# Altium project LEDS.PrjPcb
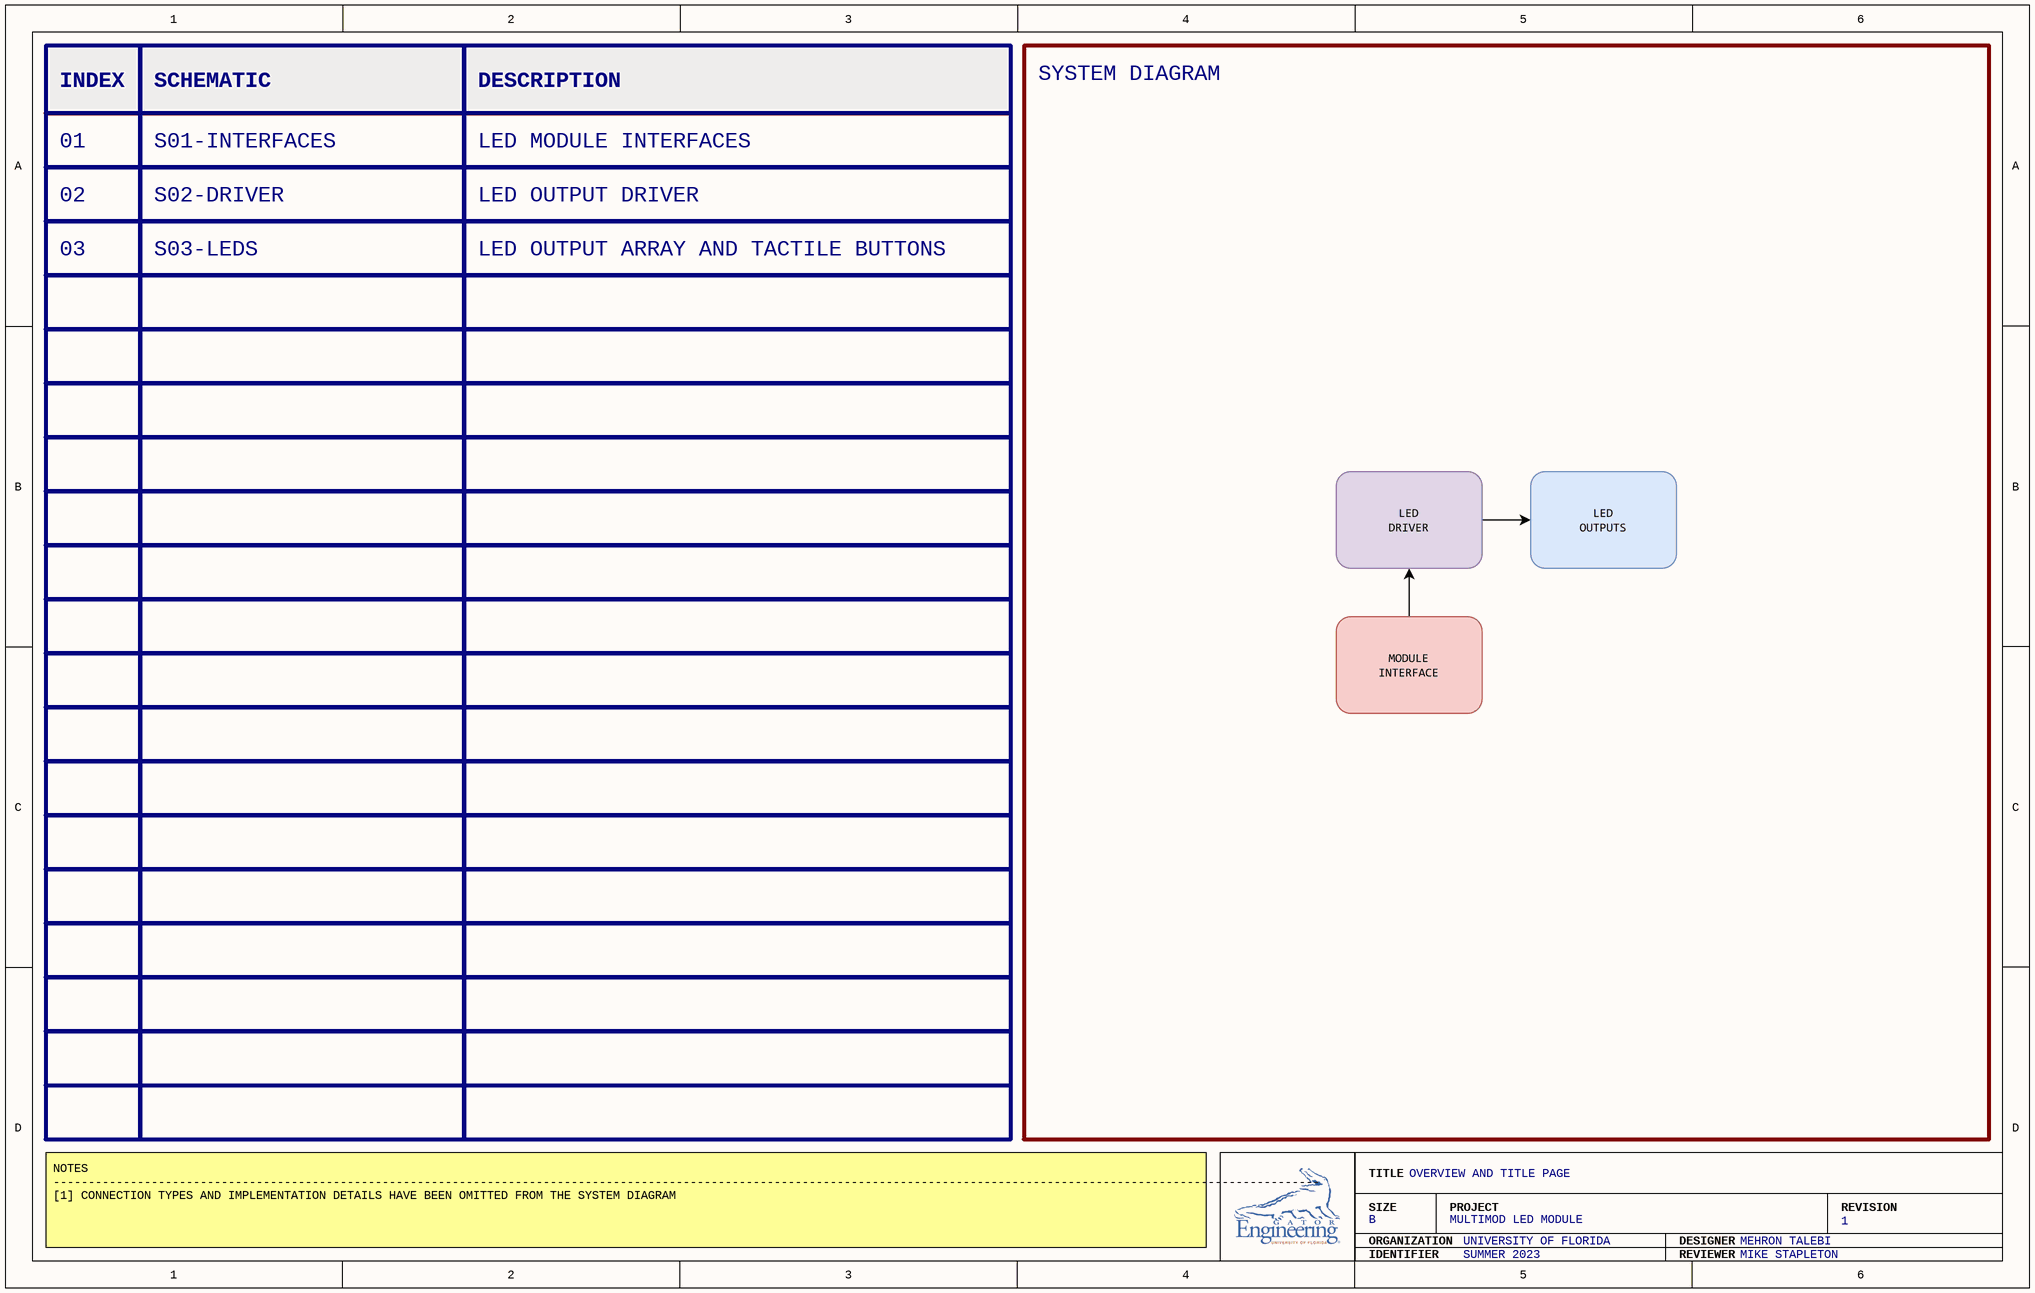
[diagram p0: S00-OVERVIEW.SchDoc]
4 sheets, 35 parts. Net scope: flat (ports and power ports of the same name join across sheets).
Board file: P01-LEDS.PcbDoc
Sheets:
  S00-OVERVIEW.SchDoc
  S01-INTERFACES.SchDoc
  S02-DRIVER.SchDoc
  S03-LEDS.SchDoc

## Sheet S00-OVERVIEW.SchDoc
size B; SheetNumber: 1; SheetTotal: 4; BLOCK-TITLE: OVERVIEW AND TITLE PAGE; BLOCK-SIZE: B; BLOCK-PROJECT: MULTIMOD LED MODULE; BLOCK-REVISION: 1; BLOCK-ORGANIZATION: UNIVERSITY OF FLORIDA; BLOCK-DESIGNER: MEHRON TALEBI; BLOCK-IDENTIFIER: SUMMER 2023; BLOCK-REVIEWER: MIKE STAPLETON

### Notes on the sheet
- INDEX
- SCHEMATIC
- DESCRIPTION
- SYSTEM DIAGRAM
- 01
- S01-INTERFACES
- LED MODULE INTERFACES
- 02
- 03
- S02-DRIVER
- S03-LEDS
- LED OUTPUT DRIVER
- LED OUTPUT ARRAY AND TACTILE BUTTONS
- NOTES
  -------------------------------------------------------------------------------------------------------------------------------------------------------------------------------------
  [1] CONNECTION TYPES AND IMPLEMENTATION DETAILS HAVE BEEN OMITTED FROM THE SYSTEM DIAGRAM
- TITLE
- SIZE
- ORGANIZATION
- PROJECT
- DESIGNER
- REVISION
- IDENTIFIER
- REVIEWER

## Sheet S01-INTERFACES.SchDoc
size B; SheetNumber: 2; SheetTotal: 4; BLOCK-TITLE: LED MODULE INTERFACES AND TACTILE BUTTONS; BLOCK-SIZE: B; BLOCK-PROJECT: MULTIMOD LED MODULE; BLOCK-REVISION: 1; BLOCK-ORGANIZATION: UNIVERSITY OF FLORIDA; BLOCK-DESIGNER: MEHRON TALEBI; BLOCK-IDENTIFIER: SUMMER 2023; BLOCK-REVIEWER: MIKE STAPLETON
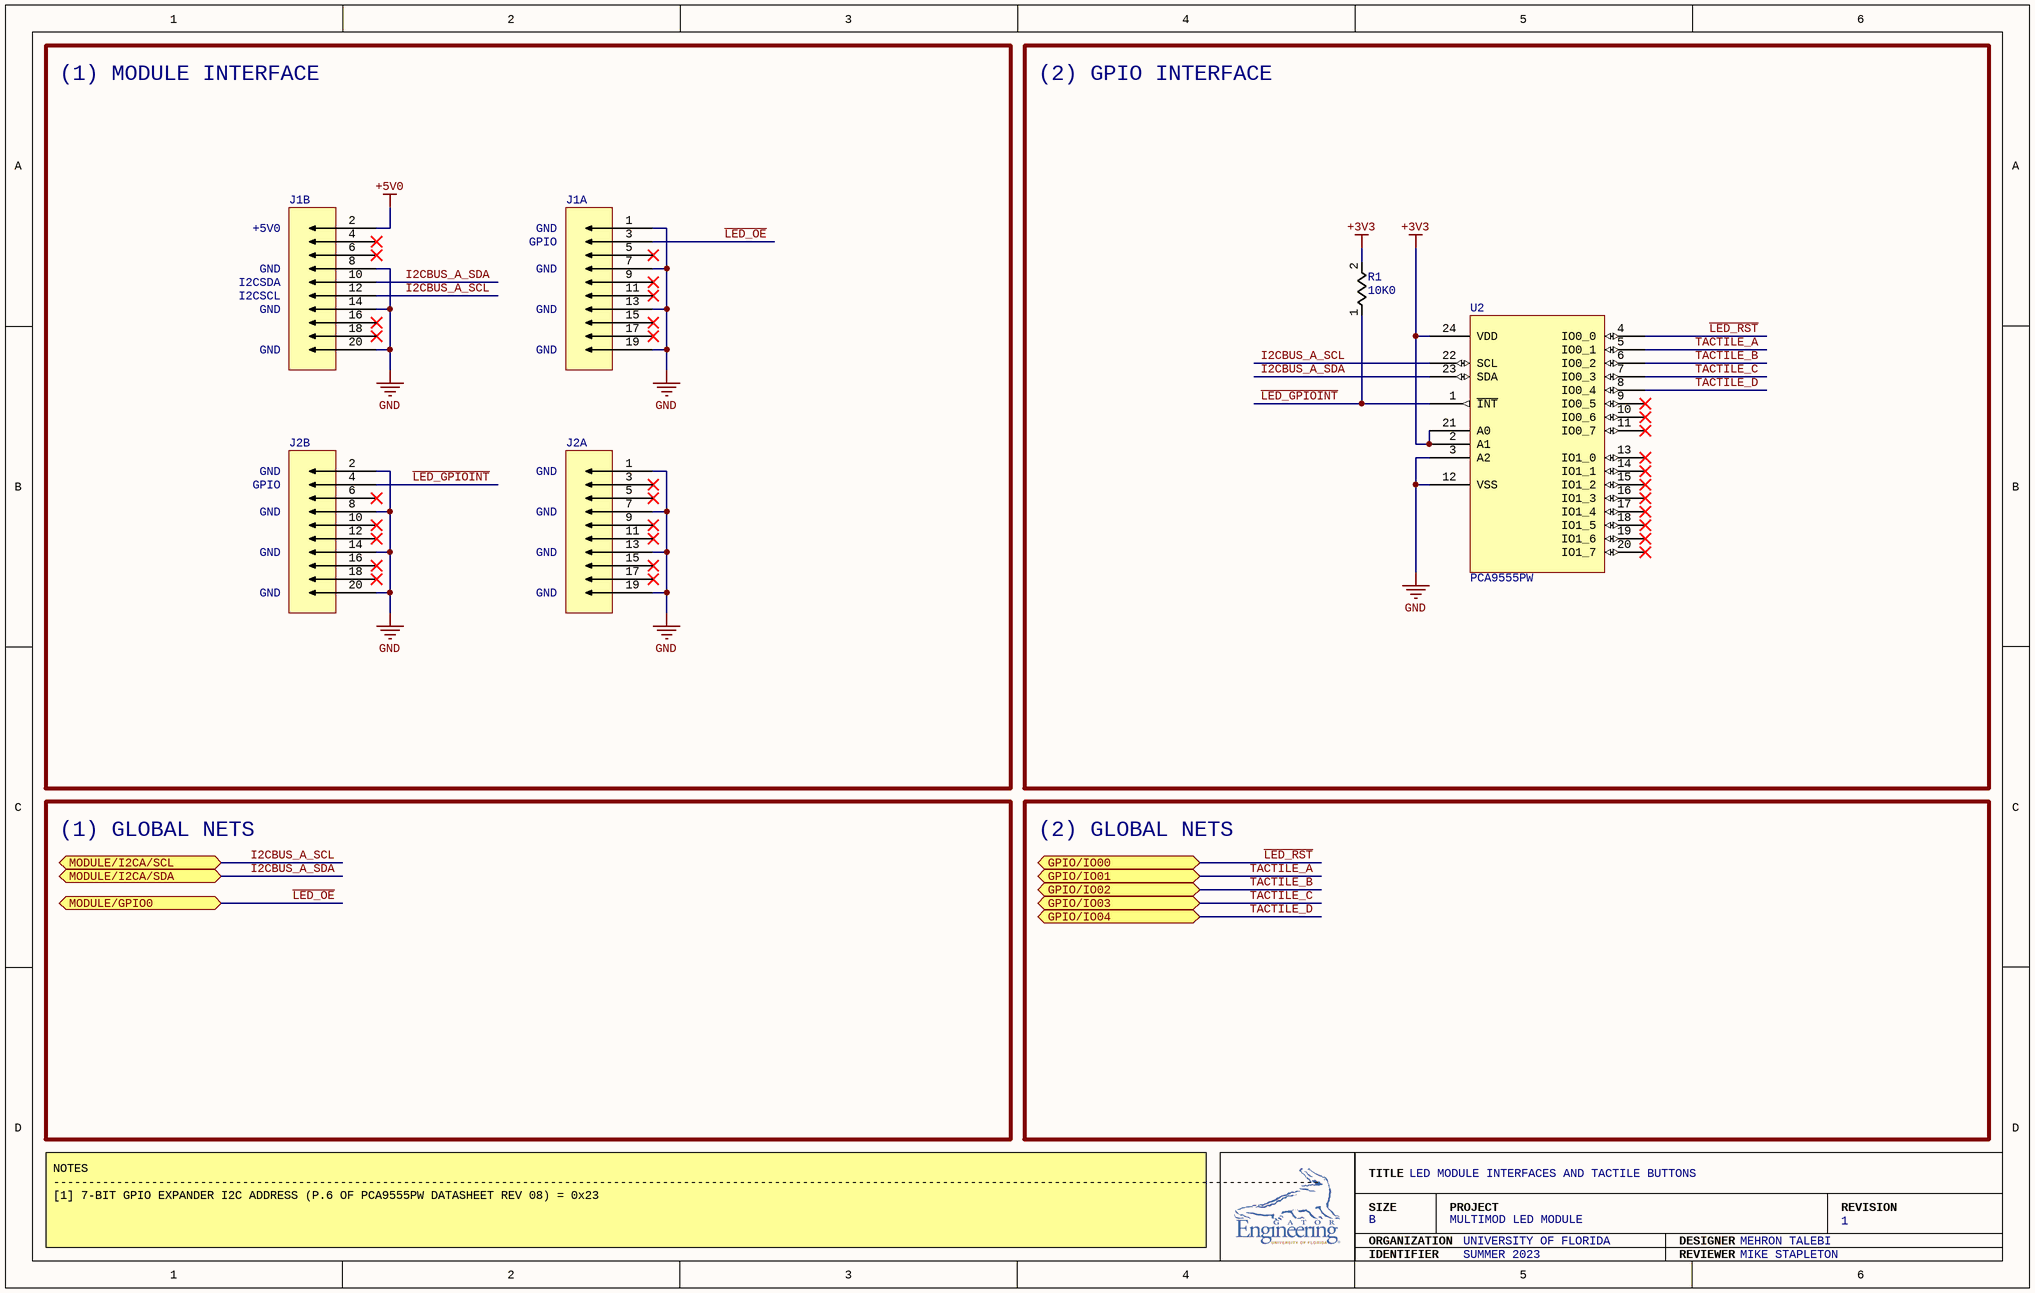
[diagram p1: S01-INTERFACES.SchDoc]

### Parts
J1  NPTC102KFMS-RC  [NPTC102KFMS-RC]  (value not drawn)  (parts A,B of 2)
J2  NPTC102KFMS-RC  [NPTC102KFMS-RC]  (value not drawn)  (parts A,B of 2)
R1  10K0  [RC0805FR-0710KL]
U2  PCA9555PW  [PCA9555PW]

### Blocks framed on the sheet
(1) MODULE INTERFACE: J1 J2
(2) GPIO INTERFACE: R1 U2

### Ports
GPIO/IO00 (bidir), GPIO/IO01 (bidir), GPIO/IO02 (bidir), GPIO/IO03 (bidir), GPIO/IO04 (bidir), MODULE/GPIO0 (bidir), MODULE/I2CA/SCL (bidir), MODULE/I2CA/SDA (bidir)

### Nets
+3V3: R1.2 U2.2(A1) U2.21(A0) U2.24(VDD)
+5V0: J1.2
GND: J1.1 J1.7 J1.8 J1.13 J1.14 J1.19 J1.20 J2.1 J2.2 J2.7 J2.8 J2.13 J2.14 J2.19 J2.20 U2.3(A2) U2.12(VSS)
~{LED_GPIOINT}: J2.4 R1.1 U2.1(~{INT})
~{LED_OE}: J1.3 ; port MODULE/GPIO0
~{LED_RST}: U2.4(IO0_0) ; port GPIO/IO00
~{TACTILE_A}: U2.5(IO0_1) ; port GPIO/IO01
~{TACTILE_B}: U2.6(IO0_2) ; port GPIO/IO02
~{TACTILE_C}: U2.7(IO0_3) ; port GPIO/IO03
~{TACTILE_D}: U2.8(IO0_4) ; port GPIO/IO04
I2CBUS_A_SCL: J1.12 U2.22(SCL) ; port MODULE/I2CA/SCL
I2CBUS_A_SDA: J1.10 U2.23(SDA) ; port MODULE/I2CA/SDA

Not connected (* = marked no-connect by the designer): J1 4* 5* 6* 9* 11* 15* 16* 17* 18*; J2 3* 5* 6* 9* 10* 11* 12* 15* 16* 17* 18*; U2 9(IO0_5)* 10(IO0_6)* 11(IO0_7)* 13(IO1_0)* 14(IO1_1)* 15(IO1_2)* 16(IO1_3)* 17(IO1_4)* 18(IO1_5)* 19(IO1_6)* 20(IO1_7)*

### Notes on the sheet
- +5V0
- GND
- GPIO
- I2CSCL
- I2CSDA
- (1) GLOBAL NETS
- (2) GLOBAL NETS
- NOTES
  -------------------------------------------------------------------------------------------------------------------------------------------------------------------------------------
  [1] 7-BIT GPIO EXPANDER I2C ADDRESS (P.6 OF PCA9555PW DATASHEET REV 08) = 0x23
- TITLE
- SIZE
- ORGANIZATION
- PROJECT
- DESIGNER
- REVISION
- IDENTIFIER
- REVIEWER

### Library data of the parts
J1 J2 = NPTC102KFMS-RC: CONN HDR 20POS 0.1 TIN SMD; Connector Type: Header; Style: Board to Board; Number of Positions: 20; Number of Positions Loaded: All; Pitch - Mating: 0.100" (2.54mm); Material Flammability Rating: UL94 V-0; Current Rating (Amps): 3A; Voltage Rating: 250V; System: Connector; Contact Type: Female Socket; Number of Rows: 2; Row Spacing - Mating: 0.100" (2.54mm); Mounting Type: Surface Mount; Termination: Solder; Fastening Type: Push-Pull; Contact Finish - Mating: Tin; Insulation Color: Black; Insulation Height: 0.299" (7.60mm); Operating Temperature: -40°C ~ 125°C; Contact Finish - Post: Tin; Insulation Material: Polyamide (PA6T), Nylon 6T; Contact Shape: Square; Contact Material: Phosphor Bronze; Supplier 1: Digi-Key; Supplier Part Number 1: S5680-ND
R1 = RC0805FR-0710KL: RES 10K OHM 1% 1/8W 0805; Resistance: 10 kOhms; Power (Watts): 0.125W, 1/8W; Temperature Coefficient: ±100ppm/°C; Tolerance: ±1%; Composition: Thick Film; Features: Moisture Resistant; Operating Temperature: -55°C ~ 155°C; Package / Case: 0805 (2012 Metric); Supplier Device Package: 0805; Size / Dimension: 0.079" L x 0.049" W (2.00mm x 1.25mm); Height - Seated (Max): 0.024" (0.60mm); Number of Terminations: 2; Supplier 1: Future Electronics; Supplier Part Number 1: 3310877
U2 = PCA9555PW: IC XPND 400KHZ I2C SMBUS 24TSSOP; Number of I/O: 16; Interface: I²C, SMBus; Interrupt Output: Yes; Output Type: Push-Pull; Current - Output Source/Sink: 10mA, 25mA; Voltage - Supply: 2.3V ~ 5.5V; Features: POR; Clock Frequency: 400 kHz; Operating Temperature: -40°C ~ 85°C; Mounting Type: Surface Mount; Package / Case: 24-TSSOP (0.173", 4.40mm Width); Supplier Device Package: 24-TSSOP; Supplier 1: Newark; Supplier Part Number 1: 24AC9600

## Sheet S02-DRIVER.SchDoc
size B; SheetNumber: 3; SheetTotal: 4; BLOCK-TITLE: LED OUTPUT DRIVER; BLOCK-SIZE: B; BLOCK-PROJECT: MULTIMOD LED MODULE; BLOCK-REVISION: 1; BLOCK-ORGANIZATION: UNIVERSITY OF FLORIDA; BLOCK-DESIGNER: MEHRON TALEBI; BLOCK-IDENTIFIER: SUMMER 2023; BLOCK-REVIEWER: MIKE STAPLETON
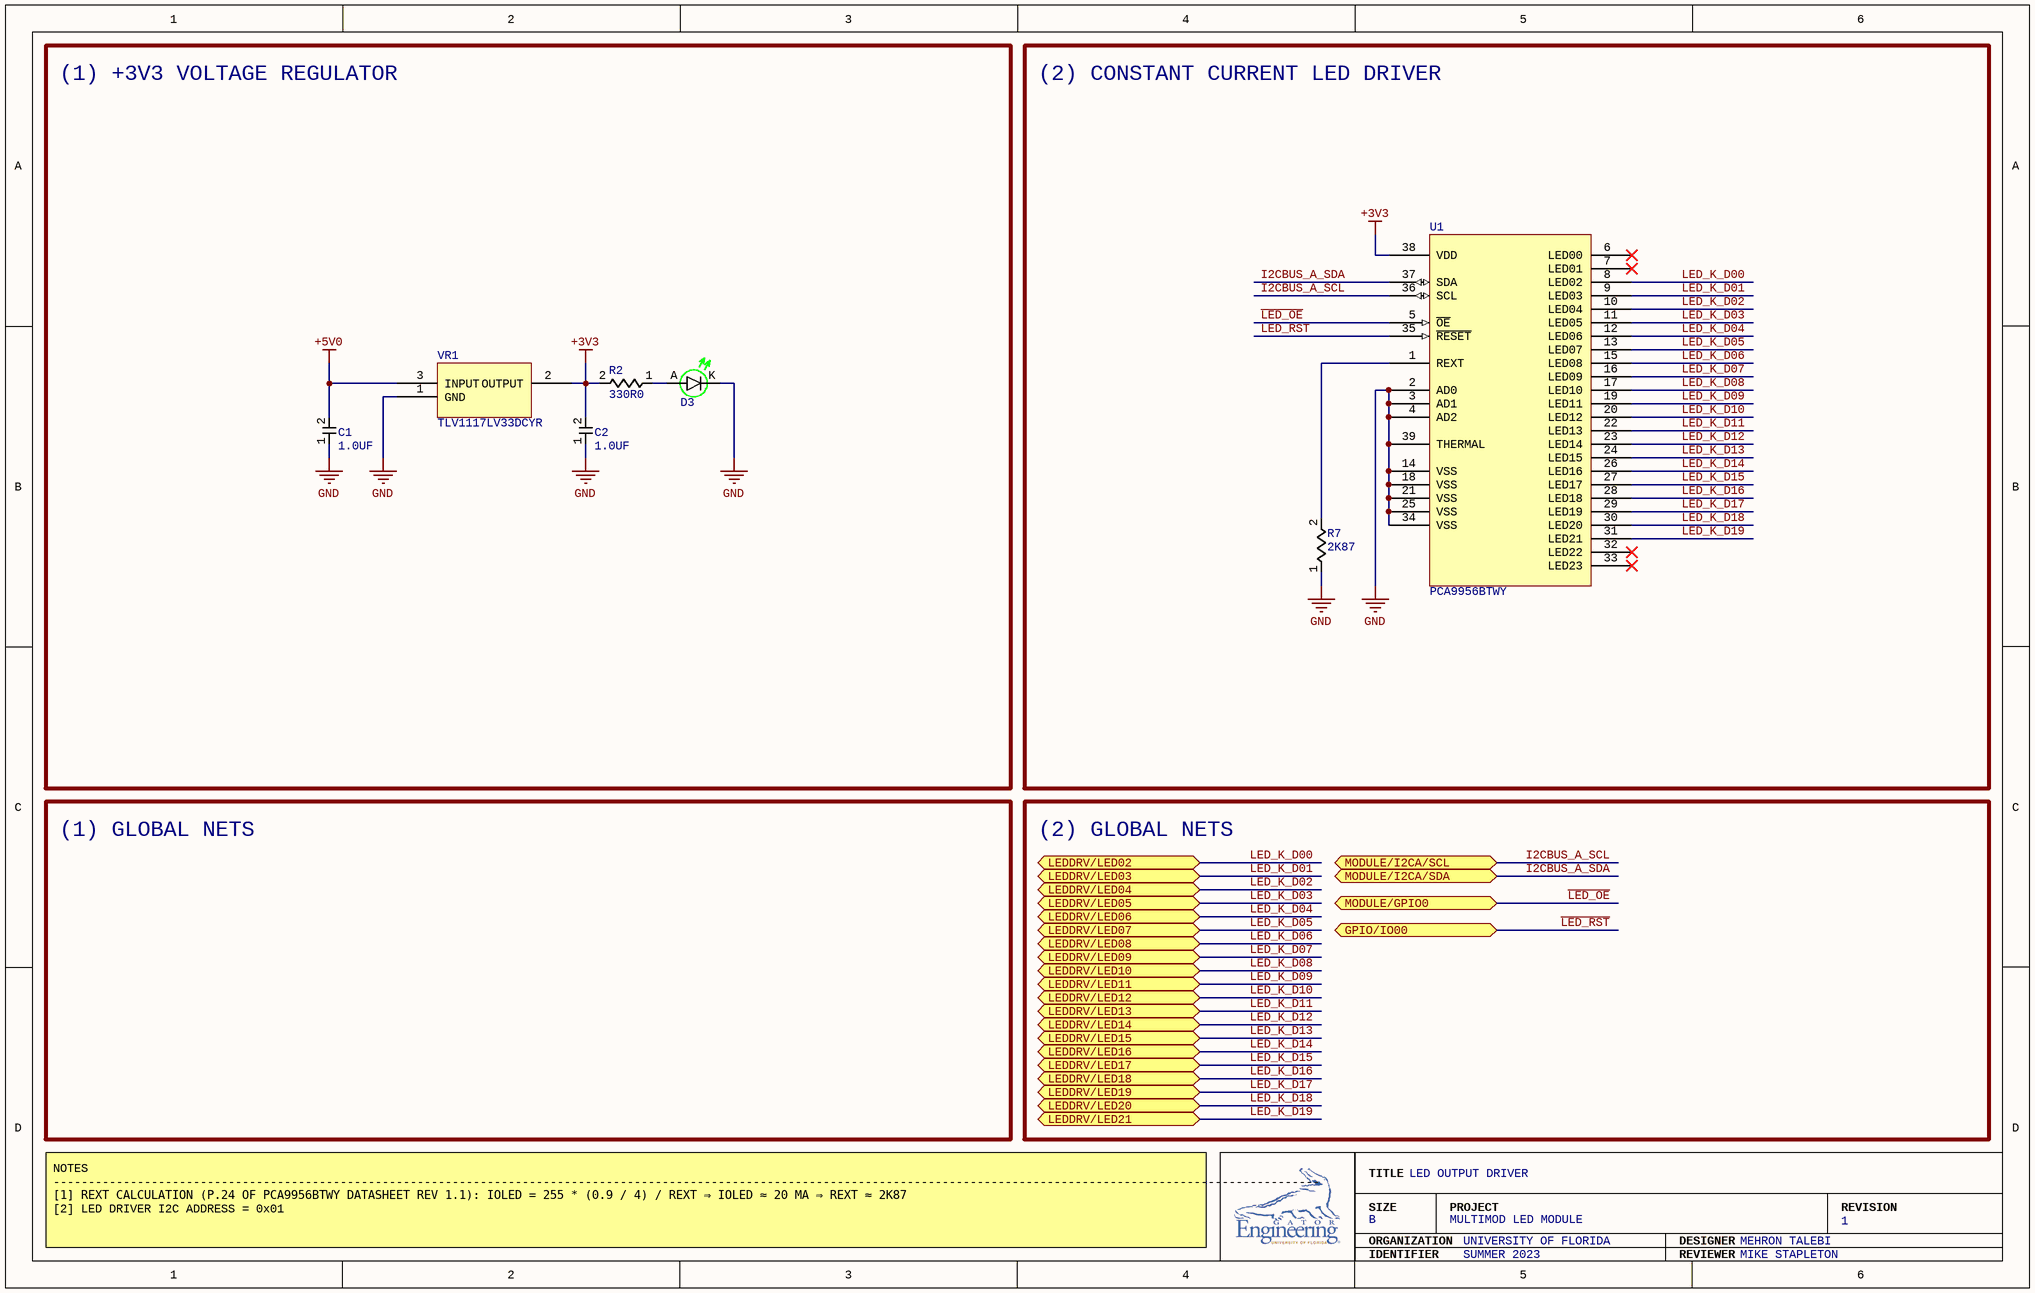
[diagram p2: S02-DRIVER.SchDoc]

### Parts
C1  1.0UF  [CL21B105KAFNFNE]
C2  1.0UF  [CL21B105KAFNFNE]
D3  LTST-C171GKT  [LTST-C171GKT]  (value not drawn)
R2  330R0  [RC0805FR-7W330RL]
R7  2K87  [RC0805FR-0710KL]
U1  PCA9956BTWY  [PCA9956BTWY]
VR1  TLV1117LV33DCYR  [TLV1117LV33DCYR]

### Blocks framed on the sheet
(1) +3V3 VOLTAGE REGULATOR: C1 C2 D3 R2 VR1
(2) CONSTANT CURRENT LED DRIVER: R7 U1

### Ports
GPIO/IO00 (bidir), LEDDRV/LED02 (bidir), LEDDRV/LED03 (bidir), LEDDRV/LED04 (bidir), LEDDRV/LED05 (bidir), LEDDRV/LED06 (bidir), LEDDRV/LED07 (bidir), LEDDRV/LED08 (bidir), LEDDRV/LED09 (bidir), LEDDRV/LED10 (bidir), LEDDRV/LED11 (bidir), LEDDRV/LED12 (bidir), LEDDRV/LED13 (bidir), LEDDRV/LED14 (bidir), LEDDRV/LED15 (bidir), LEDDRV/LED16 (bidir), LEDDRV/LED17 (bidir), LEDDRV/LED18 (bidir), LEDDRV/LED19 (bidir), LEDDRV/LED20 (bidir), LEDDRV/LED21 (bidir), MODULE/GPIO0 (bidir), MODULE/I2CA/SCL (bidir), MODULE/I2CA/SDA (bidir)

### Nets
+3V3: C2.2 R2.2 U1.38(VDD) VR1.2(OUTPUT)
+5V0: C1.2 VR1.3(INPUT)
GND: C1.1 C2.1 D3.K R7.1 U1.2(AD0) U1.3(AD1) U1.4(AD2) U1.14(VSS) U1.18(VSS) U1.21(VSS) U1.25(VSS) U1.34(VSS) U1.39(THERMAL) VR1.1(GND)
~{LED_OE}: U1.5(~{OE}) ; port MODULE/GPIO0
~{LED_RST}: U1.35(~{RESET}) ; port GPIO/IO00
I2CBUS_A_SCL: U1.36(SCL) ; port MODULE/I2CA/SCL
I2CBUS_A_SDA: U1.37(SDA) ; port MODULE/I2CA/SDA
LED_K_D00: U1.8(LED02) ; port LEDDRV/LED02
LED_K_D01: U1.9(LED03) ; port LEDDRV/LED03
LED_K_D02: U1.10(LED04) ; port LEDDRV/LED04
LED_K_D03: U1.11(LED05) ; port LEDDRV/LED05
LED_K_D04: U1.12(LED06) ; port LEDDRV/LED06
LED_K_D05: U1.13(LED07) ; port LEDDRV/LED07
LED_K_D06: U1.15(LED08) ; port LEDDRV/LED08
LED_K_D07: U1.16(LED09) ; port LEDDRV/LED09
LED_K_D08: U1.17(LED10) ; port LEDDRV/LED10
LED_K_D09: U1.19(LED11) ; port LEDDRV/LED11
LED_K_D10: U1.20(LED12) ; port LEDDRV/LED12
LED_K_D11: U1.22(LED13) ; port LEDDRV/LED13
LED_K_D12: U1.23(LED14) ; port LEDDRV/LED14
LED_K_D13: U1.24(LED15) ; port LEDDRV/LED15
LED_K_D14: U1.26(LED16) ; port LEDDRV/LED16
LED_K_D15: U1.27(LED17) ; port LEDDRV/LED17
LED_K_D16: U1.28(LED18) ; port LEDDRV/LED18
LED_K_D17: U1.29(LED19) ; port LEDDRV/LED19
LED_K_D18: U1.30(LED20) ; port LEDDRV/LED20
LED_K_D19: U1.31(LED21) ; port LEDDRV/LED21
NetD3_A: D3.A R2.1
NetR7_2: R7.2 U1.1(REXT)

Not connected (* = marked no-connect by the designer): U1 6(LED00)* 7(LED01)* 32(LED22)* 33(LED23)*

### Notes on the sheet
- (1) GLOBAL NETS
- (2) GLOBAL NETS
- NOTES
  -------------------------------------------------------------------------------------------------------------------------------------------------------------------------------------
  [1] REXT CALCULATION (P.24 OF PCA9956BTWY DATASHEET REV 1.1): IOLED = 255 * (0.9 / 4) / REXT ⇒ IOLED ≈ 20 MA ⇒ REXT ≈ 2K87
  [2] LED DRIVER I2C ADDRESS = 0x01
- TITLE
- SIZE
- ORGANIZATION
- PROJECT
- DESIGNER
- REVISION
- IDENTIFIER
- REVIEWER

### Library data of the parts
C1 C2 = CL21B105KAFNFNE: CAP CER 1UF 25V X7R 0805; Capacitance: 1 µF; Tolerance: ±10%; Voltage - Rated: 25V; Temperature Coefficient: X7R; Operating Temperature: -55°C ~ 125°C; Applications: General Purpose; Mounting Type: Surface Mount, MLCC; Package / Case: 0805 (2012 Metric); Size / Dimension: 0.079" L x 0.049" W (2.00mm x 1.25mm); Thickness (Max): 0.053" (1.35mm); Supplier 1: Arrow Electronics; Supplier Part Number 1: CL21B105KAFNFNE
D3 = LTST-C171GKT: LED GREEN CLEAR CHIP SMD; Configuration: Standard; Lens Color: Colorless; Millicandela Rating: 12mcd; Lens Style: Rectangle with Flat Top; Lens Size: 1.40mm x 1.25mm; Voltage - Forward (Vf) (Typ): 2.1V; Current - Test: 20mA; Viewing Angle: 130°; Wavelength - Dominant: 569nm; Wavelength - Peak: 565nm; Color: Green; Lens Transparency: Clear; Mounting Type: Surface Mount; Package / Case: 0805 (2012 Metric); Supplier Device Package: Chip LED; Size / Dimension: 2.00mm L x 1.25mm W; Height (Max): 0.90mm; Supplier 1: Digi-Key; Supplier Part Number 1: 160-1423-1-ND
R2 = RC0805FR-7W330RL: RES 330 OHM 1% 1/4W 0805; Resistance: 330 Ohms; Power (Watts): 0.25W, 1/4W; Temperature Coefficient: ±100ppm/°C; Tolerance: ±1%; Composition: Thick Film; Features: Moisture Resistant; Operating Temperature: -55°C ~ 155°C; Supplier Device Package: 0805; Size / Dimension: 0.079" L x 0.049" W (2.00mm x 1.25mm); Height - Seated (Max): 0.024" (0.60mm); Number of Terminations: 2; Supplier 1: Mouser; Supplier Part Number 1: 603-RC0805FR-7W330RL
R7 = RC0805FR-072K87L: RES 2.87K OHM 1% 1/8W 0805; Resistance: 2.87 kOhms; Power (Watts): 0.125W, 1/8W; Temperature Coefficient: ±100ppm/°C; Tolerance: ±1%; Composition: Thick Film; Features: Moisture Resistant; Operating Temperature: -55°C ~ 155°C; Package / Case: 0805 (2012 Metric); Supplier Device Package: 0805; Size / Dimension: 0.079" L x 0.049" W (2.00mm x 1.25mm); Height - Seated (Max): 0.024" (0.60mm); Number of Terminations: 2; Supplier 1: Future Electronics; Supplier Part Number 1: 1021979
U1 = PCA9956BTWY: IC LED DRV LIN PWM 65MA 38HTSSOP; Internal Switch(s): Yes; Number of Outputs: 24; Voltage - Supply (Min): 3V; Voltage - Supply (Max): 5.5V; Type: Linear; Current - Output / Channel: 65mA; Dimming: PWM; Applications: Backlight; Operating Temperature: -40°C ~ 85°C (TA); Mounting Type: Surface Mount; Package / Case: 38-TFSOP (0.173", 4.40mm Width) Exposed Pad; Supplier Device Package: 38-HTSSOP; Supplier 1: Arrow Electronics; Supplier Part Number 1: PCA9956BTWY
VR1 = TLV1117LV33DCYR: IC REG LINEAR 3.3V 1A SOT223-4; Output Configuration: Positive; Output Type: Fixed; Number of Regulators: 1; Voltage - Input (Max): 5.5V; Voltage Dropout (Max): 1.3V @ 800mA; Current - Quiescent (Iq): 100 µA; PSRR: 75dB (120Hz); Protection Features: Over Current, Over Temperature; Voltage - Output (Min/Fixed): 3.3V; Current - Output: 1A; Operating Temperature: -40°C ~ 125°C; Mounting Type: Surface Mount; Package / Case: TO-261-4, TO-261AA; ComponentLink1Description: Datasheet; ComponentLink1URL: https://www.ti.com/lit/ds/symlink/tlv1117lv.pdf; Supplier 1: Digi-Key; Supplier Part Number 1: 296-28778-1-ND

## Sheet S03-LEDS.SchDoc
size B; SheetNumber: 4; SheetTotal: 4; BLOCK-TITLE: LED ARRAY AND TACTILE SWITCHES; BLOCK-SIZE: B; BLOCK-PROJECT: MULTIMOD LED MODULE; BLOCK-REVISION: 1; BLOCK-ORGANIZATION: UNIVERSITY OF FLORIDA; BLOCK-DESIGNER: MEHRON TALEBI; BLOCK-IDENTIFIER: SUMMER 2023; BLOCK-REVIEWER: MIKE STAPLETON
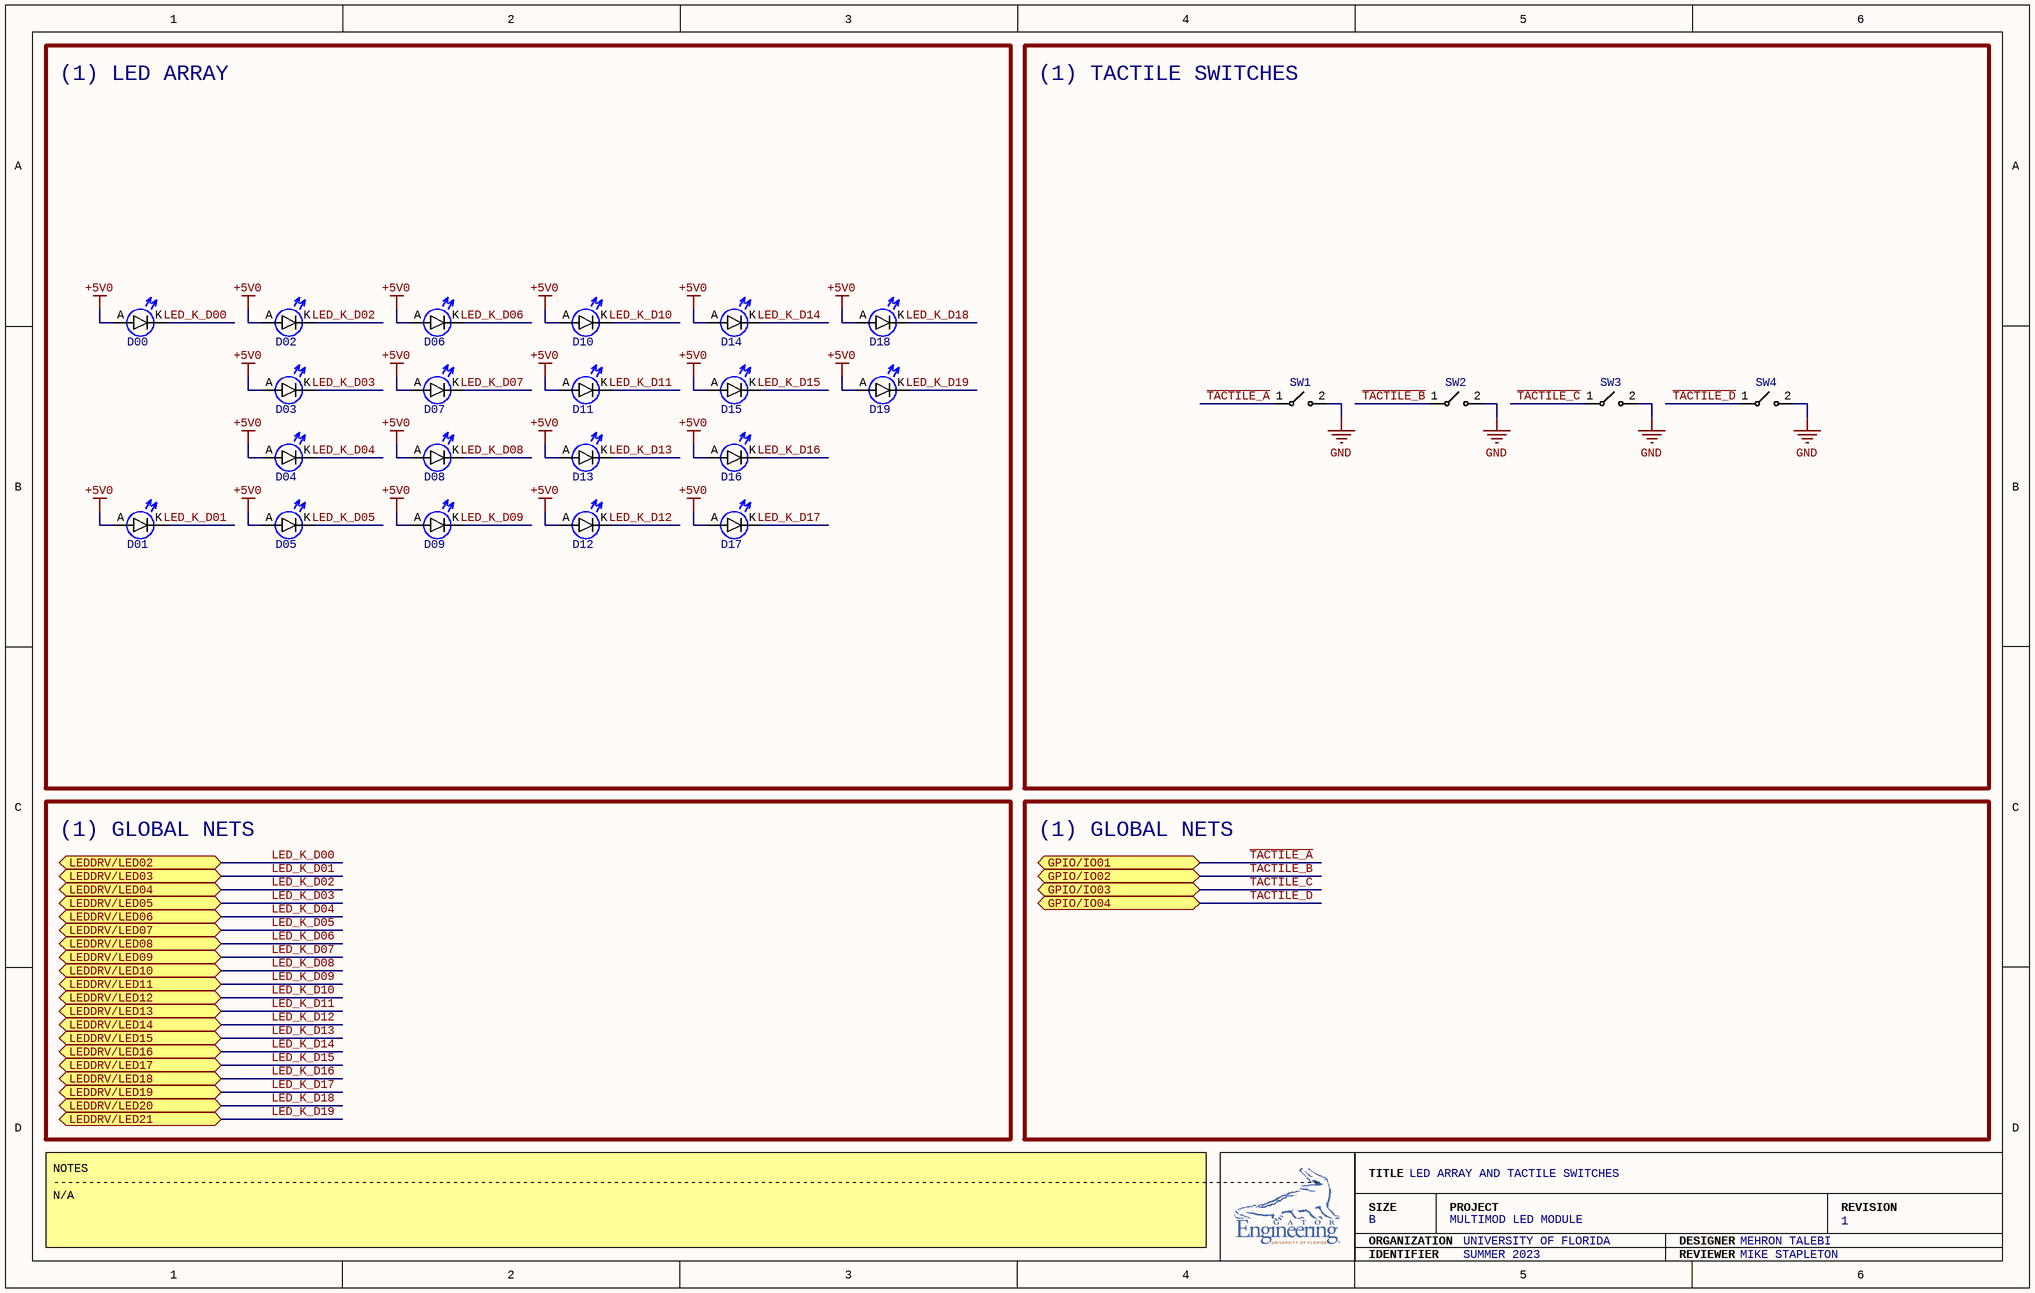
[diagram p3: S03-LEDS.SchDoc]

### Parts
D00  XZFBB45S-9  [XZFBB45S-9]  (value not drawn)
D01  XZFBB45S-9  [XZFBB45S-9]  (value not drawn)
D02  XZFBB45S-9  [XZFBB45S-9]  (value not drawn)
D03  XZFBB45S-9  [XZFBB45S-9]  (value not drawn)
D04  XZFBB45S-9  [XZFBB45S-9]  (value not drawn)
D05  XZFBB45S-9  [XZFBB45S-9]  (value not drawn)
D06  XZFBB45S-9  [XZFBB45S-9]  (value not drawn)
D07  XZFBB45S-9  [XZFBB45S-9]  (value not drawn)
D08  XZFBB45S-9  [XZFBB45S-9]  (value not drawn)
D09  XZFBB45S-9  [XZFBB45S-9]  (value not drawn)
D10  XZFBB45S-9  [XZFBB45S-9]  (value not drawn)
D11  XZFBB45S-9  [XZFBB45S-9]  (value not drawn)
D12  XZFBB45S-9  [XZFBB45S-9]  (value not drawn)
D13  XZFBB45S-9  [XZFBB45S-9]  (value not drawn)
D14  XZFBB45S-9  [XZFBB45S-9]  (value not drawn)
D15  XZFBB45S-9  [XZFBB45S-9]  (value not drawn)
D16  XZFBB45S-9  [XZFBB45S-9]  (value not drawn)
D17  XZFBB45S-9  [XZFBB45S-9]  (value not drawn)
D18  XZFBB45S-9  [XZFBB45S-9]  (value not drawn)
D19  XZFBB45S-9  [XZFBB45S-9]  (value not drawn)
SW1  TL9210AF260Q  [TL9210AF260Q]  (value not drawn)
SW2  TL9210AF260Q  [TL9210AF260Q]  (value not drawn)
SW3  TL9210AF260Q  [TL9210AF260Q]  (value not drawn)
SW4  TL9210AF260Q  [TL9210AF260Q]  (value not drawn)

### Blocks framed on the sheet
(1) LED ARRAY: D00 D01 D02 D03 D04 D05 D06 D07 D08 D09-D19
(1) TACTILE SWITCHES: SW1-SW4

### Ports
GPIO/IO01 (bidir), GPIO/IO02 (bidir), GPIO/IO03 (bidir), GPIO/IO04 (bidir), LEDDRV/LED02 (bidir), LEDDRV/LED03 (bidir), LEDDRV/LED04 (bidir), LEDDRV/LED05 (bidir), LEDDRV/LED06 (bidir), LEDDRV/LED07 (bidir), LEDDRV/LED08 (bidir), LEDDRV/LED09 (bidir), LEDDRV/LED10 (bidir), LEDDRV/LED11 (bidir), LEDDRV/LED12 (bidir), LEDDRV/LED13 (bidir), LEDDRV/LED14 (bidir), LEDDRV/LED15 (bidir), LEDDRV/LED16 (bidir), LEDDRV/LED17 (bidir), LEDDRV/LED18 (bidir), LEDDRV/LED19 (bidir), LEDDRV/LED20 (bidir), LEDDRV/LED21 (bidir)

### Nets
+5V0: D00.A D01.A D02.A D03.A D04.A D05.A D06.A D07.A D08.A D09.A D10.A D11.A D12.A D13.A D14.A D15.A D16.A D17.A D18.A D19.A
GND: SW1.2 SW2.2 SW3.2 SW4.2
~{TACTILE_A}: SW1.1 ; port GPIO/IO01
~{TACTILE_B}: SW2.1 ; port GPIO/IO02
~{TACTILE_C}: SW3.1 ; port GPIO/IO03
~{TACTILE_D}: SW4.1 ; port GPIO/IO04
LED_K_D00: D00.K ; port LEDDRV/LED02
LED_K_D01: D01.K ; port LEDDRV/LED03
LED_K_D02: D02.K ; port LEDDRV/LED04
LED_K_D03: D03.K ; port LEDDRV/LED05
LED_K_D04: D04.K ; port LEDDRV/LED06
LED_K_D05: D05.K ; port LEDDRV/LED07
LED_K_D06: D06.K ; port LEDDRV/LED08
LED_K_D07: D07.K ; port LEDDRV/LED09
LED_K_D08: D08.K ; port LEDDRV/LED10
LED_K_D09: D09.K ; port LEDDRV/LED11
LED_K_D10: D10.K ; port LEDDRV/LED12
LED_K_D11: D11.K ; port LEDDRV/LED13
LED_K_D12: D12.K ; port LEDDRV/LED14
LED_K_D13: D13.K ; port LEDDRV/LED15
LED_K_D14: D14.K ; port LEDDRV/LED16
LED_K_D15: D15.K ; port LEDDRV/LED17
LED_K_D16: D16.K ; port LEDDRV/LED18
LED_K_D17: D17.K ; port LEDDRV/LED19
LED_K_D18: D18.K ; port LEDDRV/LED20
LED_K_D19: D19.K ; port LEDDRV/LED21

### Notes on the sheet
- (1) GLOBAL NETS
- NOTES
  -------------------------------------------------------------------------------------------------------------------------------------------------------------------------------------
  N/A
- TITLE
- SIZE
- ORGANIZATION
- PROJECT
- DESIGNER
- REVISION
- IDENTIFIER
- REVIEWER

### Library data of the parts
D00 D01 D02 D03 D04 D05 D06 D07 D08 D09-D19 = XZFBB45S-9: LED BLUE CLEAR 2PLCC SMD; Configuration: Standard; Lens Color: Colorless; Millicandela Rating: 447mcd; Lens Style: Round with Flat Top; Lens Size: 2.40mm Dia; Voltage - Forward (Vf) (Typ): 3.3V; Current - Test: 20mA; Viewing Angle: 120°; Wavelength - Dominant: 470nm; Wavelength - Peak: 465nm; Color: Blue; Lens Transparency: Clear; Mounting Type: Surface Mount, Bottom Entry; Package / Case: 2-SMD, Z-Bend; Supplier Device Package: 2-PLCC; Size / Dimension: 3.20mm L x 2.80mm W; Height (Max): 1.90mm; Supplier 1: Digi-Key; Supplier Part Number 1: 1497-1233-1-ND
SW1-SW4 = TL9210AF260Q: SWITCH TACTILE SPST-NO 0.05A 12V; Switch Function: Off-Mom; Contact Rating @ Voltage: 0.05A @ 12VDC; Actuator Type: Round Button; Actuator Height off PCB, Vertical: 5.00mm; Actuator Orientation: Top Actuated; Outline: 6.00mm x 6.00mm; Illumination: Non-Illuminated; Operating Force: 260gf; Switch Travel: 1.30mm; Mechanical Life: 100,000 Cycles; Circuit: SPST-NO; Mounting Type: Surface Mount; Termination Style: J Lead; Operating Temperature: -20°C ~ 70°C; Supplier 1: Digi-Key; Supplier Part Number 1: EG2664CT-ND

## Nets that join several sheets
+3V3: S01-INTERFACES (R1.2 U2.2 U2.21 U2.24), S02-DRIVER (C2.2 R2.2 U1.38 VR1.2)
+5V0: S01-INTERFACES (J1.2), S02-DRIVER (C1.2 VR1.3), S03-LEDS (20 pins)
GND: S01-INTERFACES (17 pins), S02-DRIVER (14 pins), S03-LEDS (SW1.2 SW2.2 SW3.2 SW4.2)
~{LED_OE}: S01-INTERFACES (J1.3), S02-DRIVER (U1.5)
~{LED_RST}: S01-INTERFACES (U2.4), S02-DRIVER (U1.35)
~{TACTILE_A}: S01-INTERFACES (U2.5), S03-LEDS (SW1.1)
~{TACTILE_B}: S01-INTERFACES (U2.6), S03-LEDS (SW2.1)
~{TACTILE_C}: S01-INTERFACES (U2.7), S03-LEDS (SW3.1)
~{TACTILE_D}: S01-INTERFACES (U2.8), S03-LEDS (SW4.1)
I2CBUS_A_SCL: S01-INTERFACES (J1.12 U2.22), S02-DRIVER (U1.36)
I2CBUS_A_SDA: S01-INTERFACES (J1.10 U2.23), S02-DRIVER (U1.37)
LED_K_D00: S02-DRIVER (U1.8), S03-LEDS (D00.K)
LED_K_D01: S02-DRIVER (U1.9), S03-LEDS (D01.K)
LED_K_D02: S02-DRIVER (U1.10), S03-LEDS (D02.K)
LED_K_D03: S02-DRIVER (U1.11), S03-LEDS (D03.K)
LED_K_D04: S02-DRIVER (U1.12), S03-LEDS (D04.K)
LED_K_D05: S02-DRIVER (U1.13), S03-LEDS (D05.K)
LED_K_D06: S02-DRIVER (U1.15), S03-LEDS (D06.K)
LED_K_D07: S02-DRIVER (U1.16), S03-LEDS (D07.K)
LED_K_D08: S02-DRIVER (U1.17), S03-LEDS (D08.K)
LED_K_D09: S02-DRIVER (U1.19), S03-LEDS (D09.K)
LED_K_D10: S02-DRIVER (U1.20), S03-LEDS (D10.K)
LED_K_D11: S02-DRIVER (U1.22), S03-LEDS (D11.K)
LED_K_D12: S02-DRIVER (U1.23), S03-LEDS (D12.K)
LED_K_D13: S02-DRIVER (U1.24), S03-LEDS (D13.K)
LED_K_D14: S02-DRIVER (U1.26), S03-LEDS (D14.K)
LED_K_D15: S02-DRIVER (U1.27), S03-LEDS (D15.K)
LED_K_D16: S02-DRIVER (U1.28), S03-LEDS (D16.K)
LED_K_D17: S02-DRIVER (U1.29), S03-LEDS (D17.K)
LED_K_D18: S02-DRIVER (U1.30), S03-LEDS (D18.K)
LED_K_D19: S02-DRIVER (U1.31), S03-LEDS (D19.K)